# Altium schematic sheet [5] Power_AFE.SchDoc
size A4
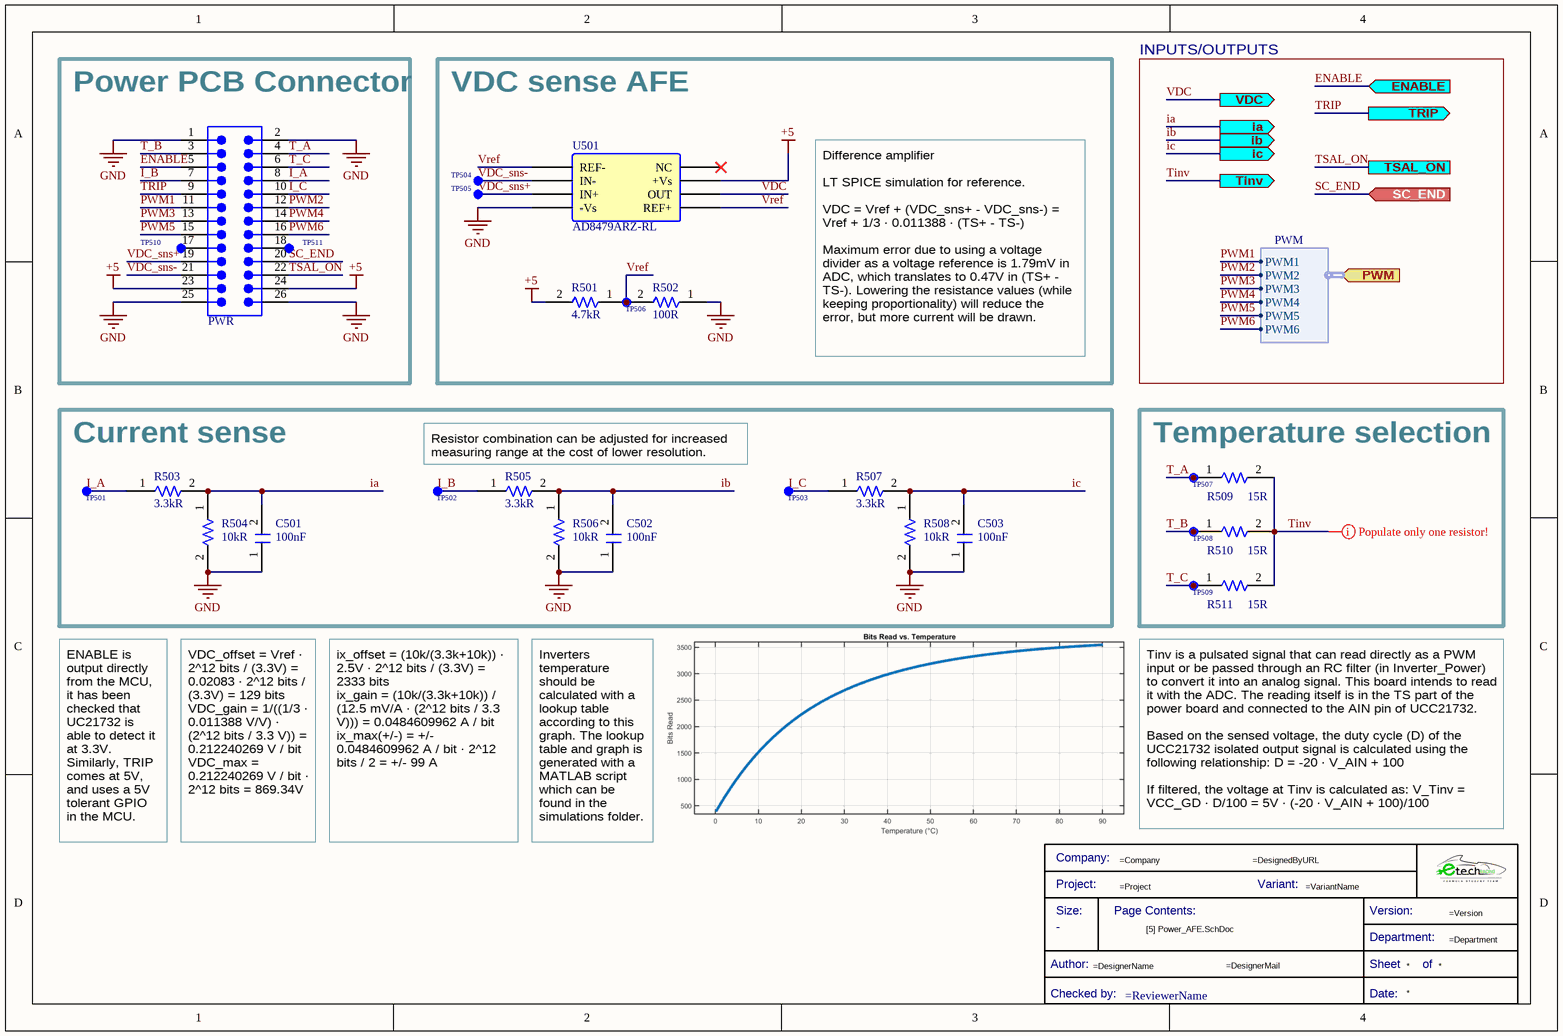
[diagram p0: [5] Power_AFE.SchDoc]

## Parts
*?  Title Block_template  (value not drawn)  (graphical)
C501  Capacitance: 100nF  [C0805FNPC-R]  (hidden comment: 885012207098)
C502  Capacitance: 100nF  [C0805FNPC-R]  (hidden comment: 885012207098)
C503  Capacitance: 100nF  [C0805FNPC-R]  (hidden comment: 885012207098)
PWR  61302621121  [61302621121]  (value not drawn)
R501  Resistance: 4.7kR  [R0805FTK]  (hidden comment: CR0805-JW-472ELF)
R502  Resistance: 100R  [R0805FTK]  (hidden comment: CR0805-FX-1000ELF)
R503  Resistance: 3.3kR  [R0805FTK]  (hidden comment: CR0805-JW-472ELF)
R504  Resistance: 10kR  [R0805FTK]  (hidden comment: CR0805-JW-103ELF)
R505  Resistance: 3.3kR  [R0805FTK]  (hidden comment: CR0805-JW-472ELF)
R506  Resistance: 10kR  [R0805FTK]  (hidden comment: CR0805-JW-103ELF)
R507  Resistance: 3.3kR  [R0805FTK]  (hidden comment: CR0805-JW-472ELF)
R508  Resistance: 10kR  [R0805FTK]  (hidden comment: CR0805-JW-103ELF)
R509  Resistance: 15R  [R0805FTK]  (hidden comment: CPF0805B15RE)
R510  Resistance: 15R  [R0805FTK]  (hidden comment: CPF0805B15RE)
R511  Resistance: 15R  [R0805FTK]  (hidden comment: CPF0805B15RE)
TP501  TestPoint  [TestPoint]  (value not drawn)  (no BOM)
TP502  TestPoint  [TestPoint]  (value not drawn)  (no BOM)
TP503  TestPoint  [TestPoint]  (value not drawn)  (no BOM)
TP504  TestPoint  [TestPoint]  (value not drawn)  (no BOM)
TP505  TestPoint  [TestPoint]  (value not drawn)  (no BOM)
TP506  TestPoint  [TestPoint]  (value not drawn)  (no BOM)
TP507  TestPoint  [TestPoint]  (value not drawn)  (no BOM)
TP508  TestPoint  [TestPoint]  (value not drawn)  (no BOM)
TP509  TestPoint  [TestPoint]  (value not drawn)  (no BOM)
TP510  TestPoint  [TestPoint]  (value not drawn)  (no BOM)
TP511  TestPoint  [TestPoint]  (value not drawn)  (no BOM)
U501  AD8479ARZ-RL  [R_8_ADI]

## Blocks framed on the sheet
Power PCB Connector: PWR TP510 TP511
VDC sense AFE: R501 R502 TP504-TP506 U501
Current sense: C501-C503 R503-R508 TP501-TP503
Temperature selection: R509-R511 TP507-TP509

## Ports
ENABLE (in), ia (out), ib (out), ic (out), PWM (in, harness PWM), SC_END (in), Tinv (out), TRIP (out), TSAL_ON, VDC (out)

## Harnesses
PWM: PWM1, PWM2, PWM3, PWM4, PWM5, PWM6

## Nets
+5: PWR.23 PWR.24 R501.2 U501.7(+Vs)
GND: C501.1 C502.1 C503.1 PWR.1 PWR.2 PWR.25 PWR.26 R502.1 R504.2 R506.2 R508.2 U501.4(-Vs)
ENABLE: PWR.5 ; port ENABLE
I_A: PWR.8 R503.1 TP501.1(TP)
I_B: PWR.7 R505.1 TP502.1(TP)
I_C: PWR.10 R507.1 TP503.1(TP)
ia: C501.2 R503.2 R504.1 ; port ia
ib: C502.2 R505.2 R506.1 ; port ib
ic: C503.2 R507.2 R508.1 ; port ic
PWM1: PWR.11 ; port PWM.PWM1
PWM2: PWR.12 ; port PWM.PWM2
PWM3: PWR.13 ; port PWM.PWM3
PWM4: PWR.14 ; port PWM.PWM4
PWM5: PWR.15 ; port PWM.PWM5
PWM6: PWR.16 ; port PWM.PWM6
SC_END: PWR.20 ; port SC_END
T_A: PWR.4 R509.1 TP507.1(TP)
T_B: PWR.3 R510.1 TP508.1(TP)
T_C: PWR.6 R511.1 TP509.1(TP)
Tinv: R509.2 R510.2 R511.2 ; port Tinv
TRIP: PWR.9 ; port TRIP
TSAL_ON: PWR.22 ; port TSAL_ON
VDC: U501.6(OUT) ; port VDC
VDC_sns+: PWR.19 TP505.1(TP) U501.3(IN+)
VDC_sns-: PWR.21 TP504.1(TP) U501.2(IN-)
Vref: R501.1 R502.2 TP506.1(TP) U501.1(REF-) U501.5(REF+)
NetPWR_17: PWR.17 TP510.1(TP)
NetPWR_18: PWR.18 TP511.1(TP)

Not connected (* = marked no-connect by the designer): U501 8(NC)*

## Layout directives
mark named Populate only one resistor!: Tinv

## Notes on the sheet
- INPUTS/OUTPUTS
- Difference amplifier
  LT SPICE simulation for reference.
  VDC = Vref + (VDC_sns+ - VDC_sns-) = Vref + 1/3 · 0.011388 · (TS+ - TS-)
  Maximum error due to using a voltage divider as a voltage reference is 1.79mV in ADC, which translates to 0.47V in (TS+ - TS-). Lowering the resistance values (while keeping proportionality) will reduce the error, but more current will be drawn.
- Resistor combination can be adjusted for increased measuring range at the cost of lower resolution.
- ENABLE is output directly from the MCU, it has been checked that UC21732 is able to detect it at 3.3V. Similarly, TRIP comes at 5V, and uses a 5V tolerant GPIO in the MCU.
- VDC_offset = Vref · 2^12 bits / (3.3V) = 0.02083 · 2^12 bits / (3.3V) = 129 bits
  VDC_gain = 1/((1/3 · 0.011388 V/V) · (2^12 bits / 3.3 V)) = 0.212240269 V / bit
  VDC_max = 0.212240269 V / bit · 2^12 bits = 869.34V
- ix_offset = (10k/(3.3k+10k)) · 2.5V · 2^12 bits / (3.3V) = 2333 bits
  ix_gain = (10k/(3.3k+10k)) / (12.5 mV/A · (2^12 bits / 3.3 V))) = 0.0484609962 A / bit
  ix_max(+/-) = +/- 0.0484609962 A / bit · 2^12 bits / 2 = +/- 99 A
- Inverters temperature should be calculated with a lookup table according to this graph. The lookup table and graph is generated with a MATLAB script which can be found in the simulations folder.
- Tinv is a pulsated signal that can read directly as a PWM input or be passed through an RC filter (in Inverter_Power) to convert it into an analog signal. This board intends to read it with the ADC. The reading itself is in the TS part of the power board and connected to the AIN pin of UCC21732.
  Based on the sensed voltage, the duty cycle (D) of the UCC21732 isolated output signal is calculated using the following relationship: D = -20 · V_AIN + 100
  If filtered, the voltage at Tinv is calculated as: V_Tinv = VCC_GD · D/100 = 5V · (-20 · V_AIN + 100)/100
- (in symbol Title Block_template) Company:; Project:; Variant:; Size:; Page Contents:; Version:; Department:; Author:; Sheet; of; Checked by:; Date:

## Library data of the parts
*? = Title Block_template: Standard Title Block; .Creator: GP; Category: Title Block; .PCBcheck: GP; .SCHcheck: GP; Checked by:: =ReviewerName; Size: -
C501-C503 = C100n-50V-0805FNPC-X7R: Cap, 0.1ΜF, 50V, 10%, X7R, 0805; Manufacturer 1: Wurth Electronics; .Creator: DR; Supplier 1: RSComponents; Manufacturer Part Number 1: 885012207098; RoHS: Yes; Category: Ceramic Capacitors; Stock 1: 8000; Pricing 1: 100=0,10200, 500=0,07100, 2000=0,06100 (GBP); Mount: Surface Mount; Case/Package: 0805; Case Code (Metric): 2012; Case Code (Imperial): 0805; Min Operating Temperature: -55°C; Max Operating Temperature: 125°C; Packaging: Cut Tape; Voltage Rating: 50V; Dielectric: X7R; Tolerance: 10%; Voltage Rating (DC): 50V; Length: 0.079inch; Width: 0.049inch; Thickness: 0.035inch; REACH SVHC: Unknown; RoHS Compliant: Yes; ComponentLink1URL: http://www.farnell.com/datasheets/1958498.pdf?src-supplier=Farnell; ComponentLink1Description: http://www.farnell.com/datasheets/1958498.pdf?src-supplier=Farnell; ComponentLink2URL: http://www.farnell.com/datasheets/1958498.pdf?src-supplier=Element14; ComponentLink2Description: http://www.farnell.com/datasheets/1958498.pdf?src-supplier=Element14; ComponentLink3URL: https://katalog.we-online.de/pbs/datasheet/885012207098.pdf?src-supplier=Digi-Key; ComponentLink3Description: https://katalog.we-online.de/pbs/datasheet/885012207098.pdf?src-supplier=Digi-Key; ComponentLink4URL: http://www.farnell.com/datasheets/1958498.pdf?src-supplier=Newark; ComponentLink4Description: http://www.farnell.com/datasheets/1958498.pdf?src-supplier=Newark; Supplier Part Number 1: 1813493
PWR = 61302621121: WR-PHD Pin Header, THT, Vertical, pitch 2.54mm, 2 Row, 26P; Manufacturer: Wurth Elektronik; Contact Resistance: 20mOhm; Rated Current: 3A; Working Voltage: 250V; Withstanding Voltage: 500V; Manufacturer Part Number: 61302621121; Category: Board-to-Board Connectors; Match Code: WR-PHD; ComponentLink1Description: Website Link; ComponentLink1URL: https://www.we-online.com/redexpert/article/61302621121?ad; ComponentLink2Description: Datasheet Link; ComponentLink2URL: https://www.we-online.com/redexpert/spec/61302621121?ad; Mount: Through Hole; Operating Temperature Max: 105°C; Operating Temperature Min: -40°C; Packaging: Bag; Gender: Pin Header; Number of Pins: 26; Number of Rows: 2; Orientation: Vertical; Pitch: 2.54mm
R501 R503 R505 R507 = R4.7K-0805FTK: Res Thick Film 0805 4.7K Ohm 5% 1/8W ±200ppm/°C Molded SMD SMD Paper Tape on Plastic Reel; Manufacturer 1: Bourns; Power Rating: 125mW; Voltage Rating: 150V; .Creator: DR; Supplier 1: Arrow Electronics; Manufacturer Part Number 1: CR0805-JW-472ELF; RoHS: Yes; Category: Chip SMD Resistors; Stock 1: 3734; Pricing 1: 1=0,05590, 10=0,01670, 25=0,01290, 100=0,00840, 250=0,00830, 500=0,00690, 1000=0,00410 (USD); Mount: Surface Mount; Case/Package: 0805; Case Code (Metric): 2012; Case Code (Imperial): 0805; Contact Plating: Tin; Min Operating Temperature: -55°C; Max Operating Temperature: 155°C; Packaging: Tape and Reel; Tolerance: 5%; Package Quantity: 1; Resistor Type: Thick Film; Number of Terminations: 2; Termination: SMD/SMT; Temperature Coefficient: 200ppm/°C; Max Power Dissipation: 125mW; Voltage Rating (DC): 150V; Features: Moisture Resistant; Series: CR0805; Resistance Tolerance: 5%; Construction: Rectangular; Length: 2mm; Width: 0.049inch; Height: 0.024inch; Depth: 1.25mm; Thickness: 508um; Radiation Hardening: No; REACH SVHC: No SVHC; Military Standard: Not; RoHS Compliant: Yes; ComponentLink1URL: https://datasheet.ciiva.com/5541/chpreztr-5541593.pdf?src-supplier=Mouser; ComponentLink1Description: https://datasheet.ciiva.com/5541/chpreztr-5541593.pdf?src-supplier=Mouser; ComponentLink2URL: https://datasheet.ciiva.com/6560/chpreztr-6560073.pdf?src-supplier=Digi-Key; ComponentLink2Description: https://datasheet.ciiva.com/6560/chpreztr-6560073.pdf?src-supplier=Digi-Key; ComponentLink3URL: https://datasheet.ciiva.com/6560/chpreztr-6560074.pdf?src-supplier=Digi-Key; ComponentLink3Description: https://datasheet.ciiva.com/6560/chpreztr-6560074.pdf?src-supplier=Digi-Key; ComponentLink4URL: https://datasheet.ciiva.com/30174/159chpreztr-30174252.pdf?src-supplier=Onlinecomponents.com; ComponentLink4Description: https://datasheet.ciiva.com/30174/159chpreztr-30174252.pdf?src-supplier=Onlinecomponents.com; ComponentLink5URL: https://datasheet.ciiva.com/9122/chpreztr-9122814.pdf?src-supplier=Avnet; ComponentLink5Description: https://datasheet.ciiva.com/9122/chpreztr-9122814.pdf?src-supplier=Avnet; ComponentLink6URL: https://datasheet.ciiva.com/22713/691949-22713272.pdf?src-supplier=Element14; ComponentLink6Description: https://datasheet.ciiva.com/22713/691949-22713272.pdf?src-supplier=Element14; ComponentLink7URL: https://datasheet.ciiva.com/6560/chpreztr-6560075.pdf?src-supplier=Digi-Key; ComponentLink7Description: https://datasheet.ciiva.com/6560/chpreztr-6560075.pdf?src-supplier=Digi-Key; Supplier Part Number 1: CR0805-JW-472ELF
R502 = R100-0805FTK: Res Thick Film 0805 100 Ohm 1% 1/8W ±100ppm/°C Molded SMD SMD Paper Tape on Plastic Reel; Manufacturer 1: Bourns; Power Rating: 125mW; Voltage Rating: 150V; .Creator: DR; Supplier 1: Arrow Electronics; Manufacturer Part Number 1: CR0805-FX-1000ELF; RoHS: Yes; Category: Chip SMD Resistors; Stock 1: 49802; Pricing 1: 1=0,05840, 10=0,03430, 25=0,01780, 100=0,00750, 250=0,00560, 500=0,00490, 3000=0,00470 (USD); Mount: Surface Mount; Case/Package: 0805; Number of Pins: 2; Contact Plating: Tin; Case Code (Imperial): 0805; Case Code (Metric): 2012; Min Operating Temperature: -55°C; Max Operating Temperature: 155°C; Tolerance: 1%; Resistor Type: Thick Film; Temperature Coefficient: 100ppm/°C; Packaging: Tape and Reel; Package Quantity: 1; Termination: SMD/SMT; Number of Terminations: 2; Max Power Dissipation: 125mW; Voltage Rating (DC): 150V; Features: Moisture Resistant; Series: CR0805; Resistance Tolerance: 1%; Construction: Rectangular; Technology: THICK FILM; Length: 2mm; Width: 1.25mm; Height: 0.5mm; Depth: 1.25mm; Thickness: 508um; Radiation Hardening: No; REACH SVHC: No SVHC; Military Standard: Not; RoHS Compliant: Yes; ComponentLink1URL: https://datasheet.ciiva.com/11809/0900766b80fcdb72-11809178.pdf?src-supplier=RSComponents; ComponentLink1Description: https://datasheet.ciiva.com/11809/0900766b80fcdb72-11809178.pdf?src-supplier=RSComponents; ComponentLink2URL: https://datasheet.ciiva.com/6547/chpreztr-6547413.pdf?src-supplier=Digi-Key; ComponentLink2Description: https://datasheet.ciiva.com/6547/chpreztr-6547413.pdf?src-supplier=Digi-Key; ComponentLink3URL: https://datasheet.ciiva.com/6547/chpreztr-6547414.pdf?src-supplier=Digi-Key; ComponentLink3Description: https://datasheet.ciiva.com/6547/chpreztr-6547414.pdf?src-supplier=Digi-Key; ComponentLink4URL: https://datasheet.ciiva.com/6547/chpreztr-6547415.pdf?src-supplier=Digi-Key; ComponentLink4Description: https://datasheet.ciiva.com/6547/chpreztr-6547415.pdf?src-supplier=Digi-Key; ComponentLink5URL: https://datasheet.ciiva.com/9120/chpreztr-9120744.pdf?src-supplier=Avnet; ComponentLink5Description: https://datasheet.ciiva.com/9120/chpreztr-9120744.pdf?src-supplier=Avnet; Supplier Part Number 1: CR0805-FX-1000ELF
R504 R506 R508 = R10k-0805FTK: BOURNS         CR0805-JW-103ELF            Surface Mount Chip Resistor, Thick Film, CR Series, 10 kohm, 125 mW,  5%, 150 V; Temperature Coefficient: 200ppm/°C; Power Rating: 125mW; Voltage Rating: 150V; Voltage Rating (DC): 100V; .Creator: DR; Supplier 1: Arrow Electronics; Manufacturer 1: Bourns; Manufacturer Part Number 1: CR0805-JW-103ELF; RoHS: Yes; Category: Chip SMD Resistors; Stock 1: 57566; Pricing 1: 1=0,05790, 10=0,01540, 25=0,01340, 100=0,00340 (USD); Mount: Surface Mount; Case/Package: 0805; Number of Pins: 2; Contact Plating: Tin; Case Code (Metric): 2012; Case Code (Imperial): 0805; Min Operating Temperature: -55°C; Max Operating Temperature: 155°C; Tolerance: 5%; Resistor Type: Thick Film; Package Quantity: 1; Packaging: Tape and Reel; Number of Terminations: 2; Termination: SMD/SMT; Max Power Dissipation: 125mW; Features: Moisture Resistant; Series: CR0805; Construction: Rectangular; Resistance Tolerance: 5%; Technology: THICK FILM; Length: 2mm; Width: 1.25mm; Height: 0.5mm; Depth: 1.25mm; Thickness: 508um; Radiation Hardening: No; REACH SVHC: No SVHC; Military Standard: Not; RoHS Compliant: Yes; ComponentLink1URL: https://datasheet.ciiva.com/11821/0900766b80fcdb72-11821135.pdf?src-supplier=RSComponents; ComponentLink1Description: https://datasheet.ciiva.com/11821/0900766b80fcdb72-11821135.pdf?src-supplier=RSComponents; ComponentLink2URL: https://datasheet.ciiva.com/9122/chpreztr-9122374.pdf?src-supplier=Avnet; ComponentLink2Description: https://datasheet.ciiva.com/9122/chpreztr-9122374.pdf?src-supplier=Avnet; ComponentLink3URL: https://datasheet.ciiva.com/22693/1902866-22693254.pdf?src-supplier=Element14; ComponentLink3Description: https://datasheet.ciiva.com/22693/1902866-22693254.pdf?src-supplier=Element14; ComponentLink4URL: https://datasheet.ciiva.com/7986/691949-7986187.pdf?src-supplier=Element14; ComponentLink4Description: https://datasheet.ciiva.com/7986/691949-7986187.pdf?src-supplier=Element14; ComponentLink5URL: https://datasheet.ciiva.com/30065/159chpreztr-30065976.pdf?src-supplier=Onlinecomponents.com; ComponentLink5Description: https://datasheet.ciiva.com/30065/159chpreztr-30065976.pdf?src-supplier=Onlinecomponents.com; ComponentLink6URL: https://datasheet.ciiva.com/16783/70154685-16783482.pdf?src-supplier=Allied+Electronics; ComponentLink6Description: https://datasheet.ciiva.com/16783/70154685-16783482.pdf?src-supplier=Allied+Electronics; ComponentLink7URL: https://datasheet.ciiva.com/5548/chpreztr-5548491.pdf?src-supplier=Mouser; ComponentLink7Description: https://datasheet.ciiva.com/5548/chpreztr-5548491.pdf?src-supplier=Mouser; ComponentLink8URL: https://datasheet.ciiva.com/6559/chpreztr-6559900.pdf?src-supplier=Digi-Key; ComponentLink8Description: https://datasheet.ciiva.com/6559/chpreztr-6559900.pdf?src-supplier=Digi-Key; ComponentLink9URL: https://datasheet.ciiva.com/6559/chpreztr-6559901.pdf?src-supplier=Digi-Key; ComponentLink9Description: https://datasheet.ciiva.com/6559/chpreztr-6559901.pdf?src-supplier=Digi-Key; ComponentLink10URL: https://datasheet.ciiva.com/7985/1856384-7985869.pdf?src-supplier=Element14; ComponentLink10Description: https://datasheet.ciiva.com/7985/1856384-7985869.pdf?src-supplier=Element14; ComponentLink11URL: https://datasheet.ciiva.com/48692/001055517-da-01-en-smd-wid-cr0805-jw-103elf-10k-ohm-1-8w-48692118.pdf?src-supplier=Conrad; ComponentLink11Description: https://datasheet.ciiva.com/48692/001055517-da-01-en-smd-wid-cr0805-jw-103elf-10k-ohm-1-8w-48692118.pdf?src-supplier=Conrad; Supplier Part Number 1: CR0805-JW-103ELF
R509-R511 = R15-0805FTN: TE Connectivity CPF Series Precision Thin Film Surface Mount Resistor 0805 Case 15 0.1% 0.1W 25ppm/C; Temperature Coefficient: 25ppm/°C; Power Rating: 100mW; .Creator: DR; Category: Resistor; ComponentLink1Description: Datasheet; ComponentLink2Description: Where buy it; Supplier 1: RSComponents; Manufacturer: TE Connectivity; Manufacturer Part Number: CPF0805B15RE; RoHS: Yes; Stock 1: 1; Pricing 1: 5=0,35100, 50=0,32700, 100=0,30500, 250=0,28400, 500=0,25900 (USD); Mount: Surface Mount; Case/Package: 0805; Min Operating Temperature: -55°C; Max Operating Temperature: 125°C; Tolerance: 0.1%; Termination: SMD/SMT; Length: 2mm; Height: 0.5mm; Depth: 1.25mm; ComponentLink3URL: https://datasheet.ciiva.com/11812/0900766b80cecff9-11812882.pdf?src-supplier=RSComponents; ComponentLink3Description: https://datasheet.ciiva.com/11812/0900766b80cecff9-11812882.pdf?src-supplier=RSComponents; Supplier Part Number 1: 6662373
TP501-TP511 = TestPoint: Test Point 1x1 mm; .Creator: GP; Category: TestPoint; .PCBcheck: GP; .SCHcheck: GP
U501 = AD8479ARZ-RL: Operational Amplifier (difference),; Manufacturer: Analog Devices; Package Body Material: Plastic; Throw Configuration: ANALOG CIRCUIT; Neg Supply Voltage-Max (Vsup): -18V; Neg Supply Voltage-Min (Vsup): -2.5V; Neg Supply Voltage-Nom (Vsup): -15V; Channels: 1; Max Supply Voltage: 18V; Min Supply Voltage: 2.5V; Nominal Supply Voltage: 15V; Time @ Peak Reflow Temperature-Max (s): 30s; Supplier: Arrow Electronics; Supplier Part Number: AD8479ARZ-RL; Manufacturer Part Number: AD8479ARZ-RL; RoHS: Yes; Category: Amplifiers - Op Amps, Buffer, Instrumentation; Stock: 5057; Pricing: 1=5,7443, 10=5,6868, 25=5,6304, 100=5,5741, 250=5,5177, 500=5,4625 (USD); Case/Package: SOP; Pins: 8; Package Shape: Rectangular; Terminal Finish: Tin; Min Operating Temperature: -40°C; Max Operating Temperature: 125°C; JESD-609 Code: e3; JESD-30 Code: R-PDSO-G8; Moisture Sensitivity Level: 1; Package Style: SMALL OUTLINEMeter; Peak Reflow Temperature (Cel): 260°C; Surface Mount: Yes; Terminal Form: Gull Wing; Terminal Position: DUAL; Length: 4.9mm; Width: 3.9mm; Height - Seated (Max): 1.75mm; Terminal Pitch: 1.27mm; Temperature Grade: AUTOMOTIVE; Reach SVHC Compliant: Yes; RoHS Compliant: Yes; ComponentLink1URL: https://datasheet.ciiva.com:443/pdfs/VipMasterIC/IC/ANDI/ANDI-S-A0008872860/ANDI-S-A0008872860-1.pdf?src-supplier=IHS+Markit; ComponentLink1Description: https://datasheet.ciiva.com:443/pdfs/VipMasterIC/IC/ANDI/ANDI-S-A0008872860/ANDI-S-A0008872860-1.pdf?src-supplier=IHS+Markit; ComponentLink2URL: https://datasheet.ciiva.com/30008/ad8479-30008102.pdf?src-supplier=Avnet; ComponentLink2Description: https://datasheet.ciiva.com/30008/ad8479-30008102.pdf?src-supplier=Avnet